# Altium schematic sheet FT2232HL_master.SchDoc
size 420 x 297 mm; SheetNumber: 1; SheetTotal: 1
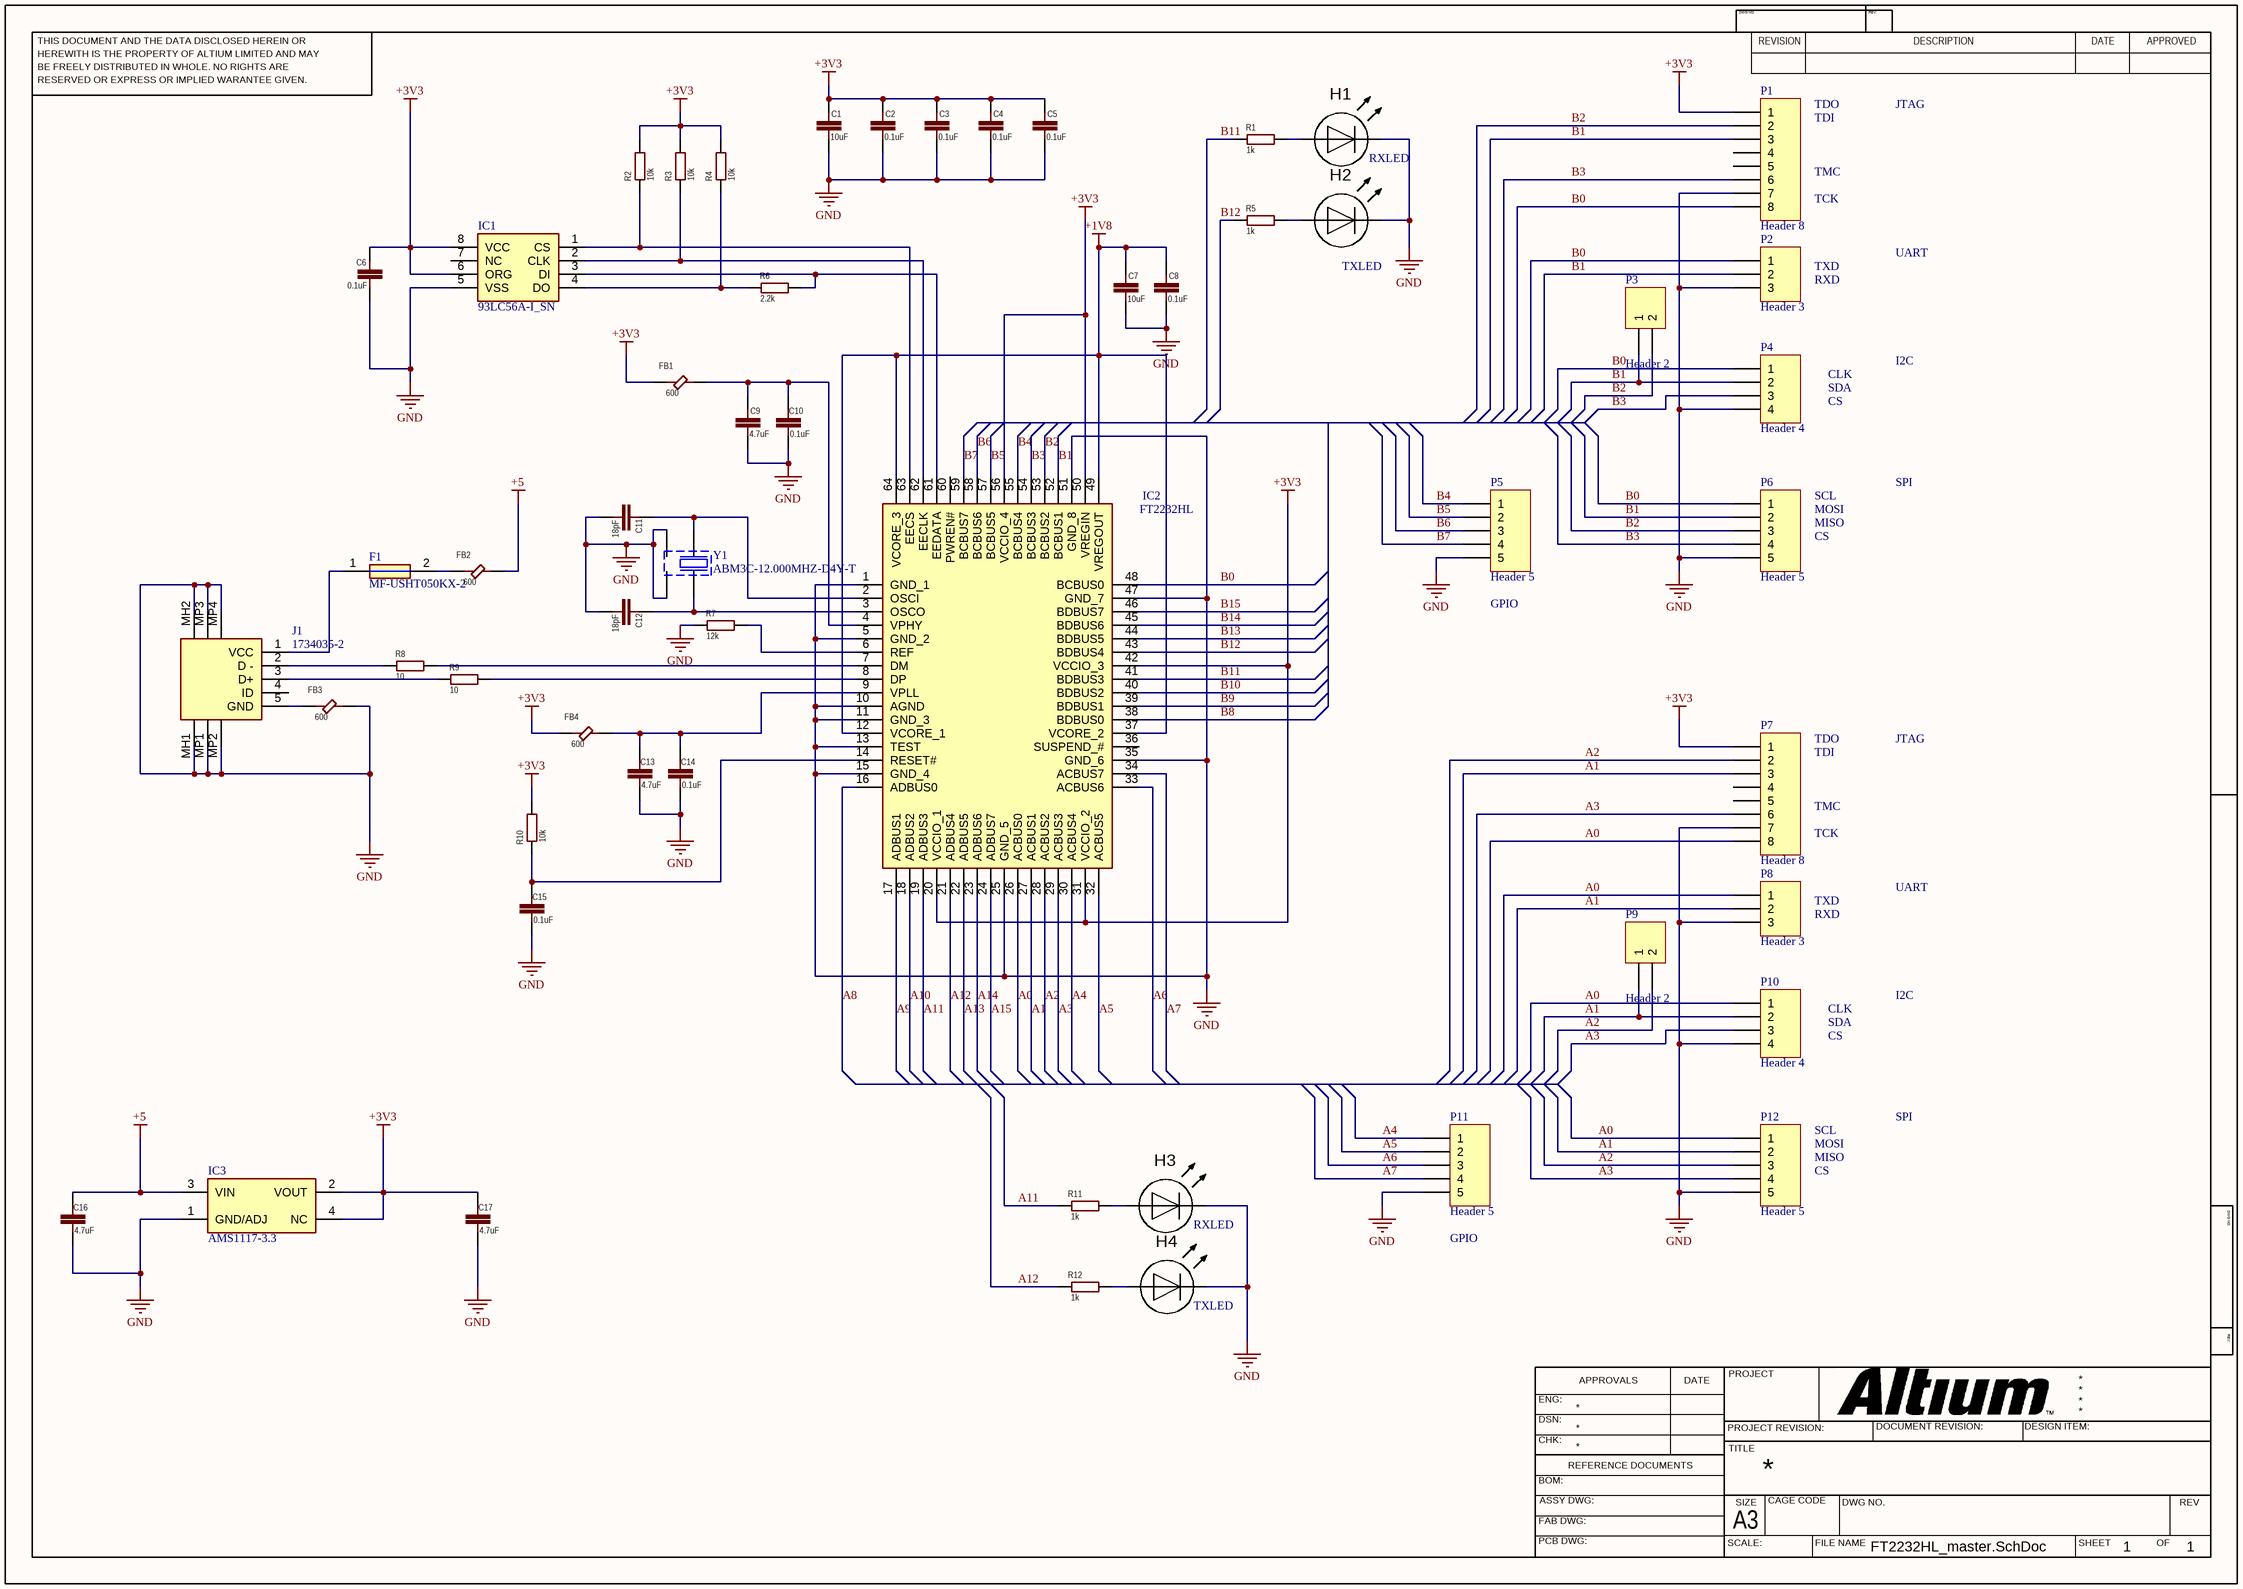
[diagram p0: FT2232HL_master.SchDoc]

## Parts
C1  10uF  [C_0805]
C2  0.1uF  [C_0603]
C3  0.1uF  [C_0603]
C4  0.1uF  [C_0603]
C5  0.1uF  [C_0603]
C6  0.1uF  [C_0603]
C7  10uF  [C_0805]
C8  0.1uF  [C_0603]
C9  4.7uF  [C_0603]
C10  0.1uF  [C_0603]
C11  18pF  [C_0603]
C12  18pF  [C_0603]
C13  4.7uF  [C_0603]
C14  0.1uF  [C_0603]
C15  0.1uF  [C_0603]
C16  4.7uF  [C_0603]
C17  4.7uF  [C_0603]
F1  MF-USHT050KX-2  [FUSC3226X85N]
FB1  600  [R_0603]
FB2  600  [R_0805]
FB3  600  [R_0805]
FB4  600  [R_0603]
H1  LED  [LED 0603_1608 GREEN]  (value not drawn)
H2  LED  [LED 0603_1608 GREEN]  (value not drawn)
H3  LED  [LED 0603_1608 GREEN]  (value not drawn)
H4  LED  [LED 0603_1608 GREEN]  (value not drawn)
IC1  93LC56A-I_SN  [SOIC127P600X175-8N]
IC2  FT2232HL  [QFP50P1200X1200X160-64N]
IC3  AMS1117-3.3  [SOT229P700X180-4N]
J1  1734035-2  [17340352]
P1  Header 8  [HDR1X8]
P2  Header 3  [HDR1X3]
P3  Header 2  [HDR1X2]
P4  Header 4  [HDR1X4]
P5  Header 5  [HDR1X5]
P6  Header 5  [HDR1X5]
P7  Header 8  [HDR1X8]
P8  Header 3  [HDR1X3]
P9  Header 2  [HDR1X2]
P10  Header 4  [HDR1X4]
P11  Header 5  [HDR1X5]
P12  Header 5  [HDR1X5]
R1  1k  [R_0603]
R2  10k  [R_0603]
R3  10k  [R_0603]
R4  10k  [R_0603]
R5  1k  [R_0603]
R6  2.2k  [R_0603]
R7  12k  [R_0603]
R8  10  [R_0603]
R9  10  [R_0603]
R10  10k  [R_0603]
R11  1k  [R_0603]
R12  1k  [R_0603]
Y1  ABM3C-12.000MHZ-D4Y-T  [ABM3C10000MHZD4YT]

## Nets
+1V8: C7.2 C8.2 IC2.12(VCORE_1) IC2.37(VCORE_2) IC2.49(VREGOUT) IC2.64(VCORE_3)
+3V3: C1.2 C2.2 C3.2 C4.2 C5.2 C6.2 C17.2 FB1.1 FB4.1 IC1.6(ORG) IC1.8(VCC) IC2.20(VCCIO_1) IC2.31(VCCIO_2) IC2.42(VCCIO_3) IC2.50(VREGIN) IC2.56(VCCIO_4) IC3.2(VOUT) IC3.4(NC) P1.1 P7.1 R2.2 R3.2 R4.2 R10.2
+5: C16.2 FB2.2 IC3.3(VIN)
GND: C1.1 C2.1 C3.1 C4.1 C5.1 C6.1 C7.1 C8.1 C9.1 C10.1 C11.1 C12.1 C13.1 C14.1 C15.1 C16.1 C17.1 FB3.2 H1.2(C) H2.2(C) H3.2(C) H4.2(C) IC1.5(VSS) IC2.1(GND_1) IC2.5(GND_2) IC2.10(AGND) IC2.11(GND_3) IC2.13(TEST) IC2.15(GND_4) IC2.25(GND_5) IC2.35(GND_6) IC2.47(GND_7) IC2.51(GND_8) IC3.1(GND/ADJ) J1.MH1 J1.MH2 J1.MP1 J1.MP2 J1.MP3 J1.MP4 P1.7 P2.3 P4.4 P5.5 P6.5 P7.7 P8.3 P10.4 P11.5 P12.5 R7.1 Y1.2(GND_1) Y1.4(GND_2)
A0: IC2.26(ACBUS0) P7.8 P8.1 P10.1 P12.1
A1: IC2.27(ACBUS1) P7.3 P8.2 P9.1 P10.2 P12.2
A2: IC2.28(ACBUS2) P7.2 P9.2 P12.3
A3: IC2.29(ACBUS3) P7.6 P10.3 P12.4
A4: IC2.30(ACBUS4) P11.1
A5: IC2.32(ACBUS5) P11.2
A6: IC2.33(ACBUS6) P11.3
A7: IC2.34(ACBUS7) P11.4
A8: IC2.16(ADBUS0)
A9: IC2.17(ADBUS1)
A10: IC2.18(ADBUS2)
A11: IC2.19(ADBUS3) R11.1
A12: IC2.21(ADBUS4) R12.1
A13: IC2.22(ADBUS5)
A14: IC2.23(ADBUS6)
A15: IC2.24(ADBUS7)
B0: IC2.48(BCBUS0) P1.8 P2.1 P4.1 P6.1
B1: IC2.52(BCBUS1) P1.3 P2.2 P3.1 P4.2 P6.2
B2: IC2.53(BCBUS2) P1.2 P3.2 P6.3
B3: IC2.54(BCBUS3) P1.6 P4.3 P6.4
B4: IC2.55(BCBUS4) P5.1
B5: IC2.57(BCBUS5) P5.2
B6: IC2.58(BCBUS6) P5.3
B7: IC2.59(BCBUS7) P5.4
B8: IC2.38(BDBUS0)
B9: IC2.39(BDBUS1)
B10: IC2.40(BDBUS2)
B11: IC2.41(BDBUS3) R1.1
B12: IC2.43(BDBUS4) R5.1
B13: IC2.44(BDBUS5)
B14: IC2.45(BDBUS6)
B15: IC2.46(BDBUS7)
NetC9_2: C9.2 C10.2 FB1.2 IC2.4(VPHY)
NetC11_2: C11.2 IC2.2(OSCI) Y1.1(CRYSTAL_1)
NetC12_2: C12.2 IC2.3(OSCO) Y1.3(CRYSTAL_2)
NetC13_2: C13.2 C14.2 FB4.2 IC2.9(VPLL)
NetC15_2: C15.2 IC2.14(RESET#) R10.1
NetF1_1: F1.1 J1.1(VCC)
NetF1_2: F1.2 FB2.1
NetFB3_1: FB3.1 J1.5(GND)
NetH1_1: H1.1(A) R1.2
NetH2_1: H2.1(A) R5.2
NetH3_1: H3.1(A) R11.2
NetH4_1: H4.1(A) R12.2
NetIC1_1: IC1.1(CS) IC2.63(EECS) R2.1
NetIC1_2: IC1.2(CLK) IC2.62(EECLK) R3.1
NetIC1_3: IC1.3(DI) IC2.61(EEDATA) R6.2
NetIC1_4: IC1.4(DO) R4.1 R6.1
NetIC2_6: IC2.6(REF) R7.2
NetIC2_7: IC2.7(DM) R8.2
NetIC2_8: IC2.8(DP) R9.2
NetJ1_2: J1.2(D_-) R8.1
NetJ1_3: J1.3(D+) R9.1

Not connected (* = marked no-connect by the designer): IC1 7(NC); IC2 36(SUSPEND_#) 60(PWREN#); J1 4(ID); P1 4 5; P7 4 5

## Notes on the sheet
- TDO
- TDI
- JTAG
- (near H1) RXLED
- TMC
- TCK
- UART
- (near H2) TXLED
- TXD
- RXD
- CLK
- SDA
- I2C
- CS
- SCL
- MOSI
- MISO
- SPI
- (near P5) GPIO
- (near H3) RXLED
- (near P11) GPIO
- (near H4) TXLED
- THIS DOCUMENT AND THE DATA DISCLOSED HEREIN OR
- HEREWITH IS THE PROPERTY OF ALTIUM LIMITED AND MAY
- DWG NO:
- REVISION
- REV:
- DESCRIPTION
- DATE
- APPROVED
- BE FREELY DISTRIBUTED IN WHOLE. NO RIGHTS ARE
- RESERVED OR EXPRESS OR IMPLIED WARANTEE GIVEN.
- ENG:
- APPROVALS
- PROJECT
- DSN:
- CHK:
- REFERENCE DOCUMENTS
- PROJECT REVISION:
- TITLE
- DOCUMENT REVISION:
- DESIGN ITEM:
- BOM:
- FAB DWG:
- PCB DWG:
- ASSY DWG:
- SCALE:
- A3
- SIZE
- CAGE CODE
- FILE NAME
- DWG NO.
- SHEET
- OF
- REV

## Library data of the parts
C1-C17 = C
F1 = MF-USHT050KX-2: Fuse; Manufacturer_Name: Bourns; Datasheet Link: https://www.bourns.com/docs/product-datasheets/mfusht.pdf; Height: 0.85mm; Manufacturer_Part_Number: MF-USHT050KX-2; Mouser Part Number: 652-MF-USHT050KX-2; Mouser Price/Stock: https://www.mouser.co.uk/ProductDetail/Bourns/MF-USHT050KX-2?qs=5aG0NVq1C4wyuZxBpUOWmw%3D%3D; Arrow Part Number: MF-USHT050KX-2; Arrow Price/Stock: https://www.arrow.com/en/products/mf-usht050kx-2/bourns?region=nac
FB1-FB4 = FB: Ferrite Bead
IC1 = 93LC56A-I_SN: Integrated Circuit; Manufacturer_Name: Microchip; Manufacturer_Part_Number: 93LC56A-I/SN; Datasheet Link: https://ww1.microchip.com/downloads/en/DeviceDoc/21794G.pdf; Height: 1.75mm; Mouser Part Number: 579-93LC56A-I/SN; Mouser Price/Stock: https://www.mouser.co.uk/ProductDetail/Microchip-Technology-Atmel/93LC56A-I-SN?qs=sX%2FisSQq3c4s3olCwy%2F09Q%3D%3D; Arrow Part Number: 93LC56A-I/SN; Arrow Price/Stock: https://www.arrow.com/en/products/93lc56a-isn/microchip-technology?region=nac
IC2 = FT2232HL: Integrated Circuit; Manufacturer_Name: FTDI Chip; Height: 1.6mm; Manufacturer_Part_Number: FT2232HL
IC3 = AMS1117-3.3: LDO 3.3V; Manufacturer_Name: Advanced; Datasheet Link: https://datasheet.datasheetarchive.com/originals/distributors/Datasheets-28/DSA-550594.pdf; Height: 1.8mm; Manufacturer_Part_Number: AMS1117-3.3
J1 = 1734035-2: Connector; Manufacturer_Name: TE Connectivity; Datasheet Link: https://www.te.com/commerce/DocumentDelivery/DDEController?Action=srchrtrv&DocNm=1-1773453-6&DocType=Data+Sheet&DocLang=English&PartCntxt=1734035-2&DocFormat=pdf; Height: 3.95mm; Manufacturer_Part_Number: 1734035-2; Mouser Part Number: 571-1734035-2; Mouser Price/Stock: https://www.mouser.co.uk/ProductDetail/TE-Connectivity/1734035-2?qs=Lu3apKW7jUhaCoyjqYNFIA%3D%3D; Arrow Part Number: 1734035-2; Arrow Price/Stock: https://www.arrow.com/en/products/1734035-2/te-connectivity?region=nac
P1 P7 = Header 8: Header, 8-Pin; LatestRevisionDate: 17-Jul-2002; LatestRevisionNote: Re-released for DXP Platform.; Publisher: Altium Limited
P2 P8 = Header 3: Header, 3-Pin; LatestRevisionDate: 17-Jul-2002; LatestRevisionNote: Re-released for DXP Platform.; Publisher: Altium Limited
P3 P9 = Header 2: Header, 2-Pin; LatestRevisionDate: 17-Jul-2002; LatestRevisionNote: Re-released for DXP Platform.; Publisher: Altium Limited
P4 P10 = Header 4: Header, 4-Pin; LatestRevisionDate: 17-Jul-2002; LatestRevisionNote: Re-released for DXP Platform.; Publisher: Altium Limited
P5 P6 P11 P12 = Header 5: Header, 5-Pin; LatestRevisionDate: 17-Jul-2002; LatestRevisionNote: Re-released for DXP Platform.; Publisher: Altium Limited
R1-R12 = R
Y1 = ABM3C-10.000MHZ-D4Y-T: Crystal or Oscillator; Manufacturer_Name: ABRACON; Datasheet Link: https://www.mouser.com/datasheet/2/3/abm3c-1775120.pdf; Height: 1.3mm; Manufacturer_Part_Number: ABM3C-10.000MHZ-D4Y-T; Mouser Part Number: 815-ABM3C-10-D4YT; Mouser Price/Stock: https://www.mouser.co.uk/ProductDetail/ABRACON/ABM3C-10000MHZ-D4Y-T?qs=hxOQwdLlgeqTP8bcyrKgbg%3D%3D; Arrow Part Number: ABM3C-10.000MHZ-D4Y-T; Arrow Price/Stock: https://www.arrow.com/en/products/abm3c-10.000mhz-d4y-t/abracon